# Altium project Smoke_Detector.PrjPcb (part 1 of 4)
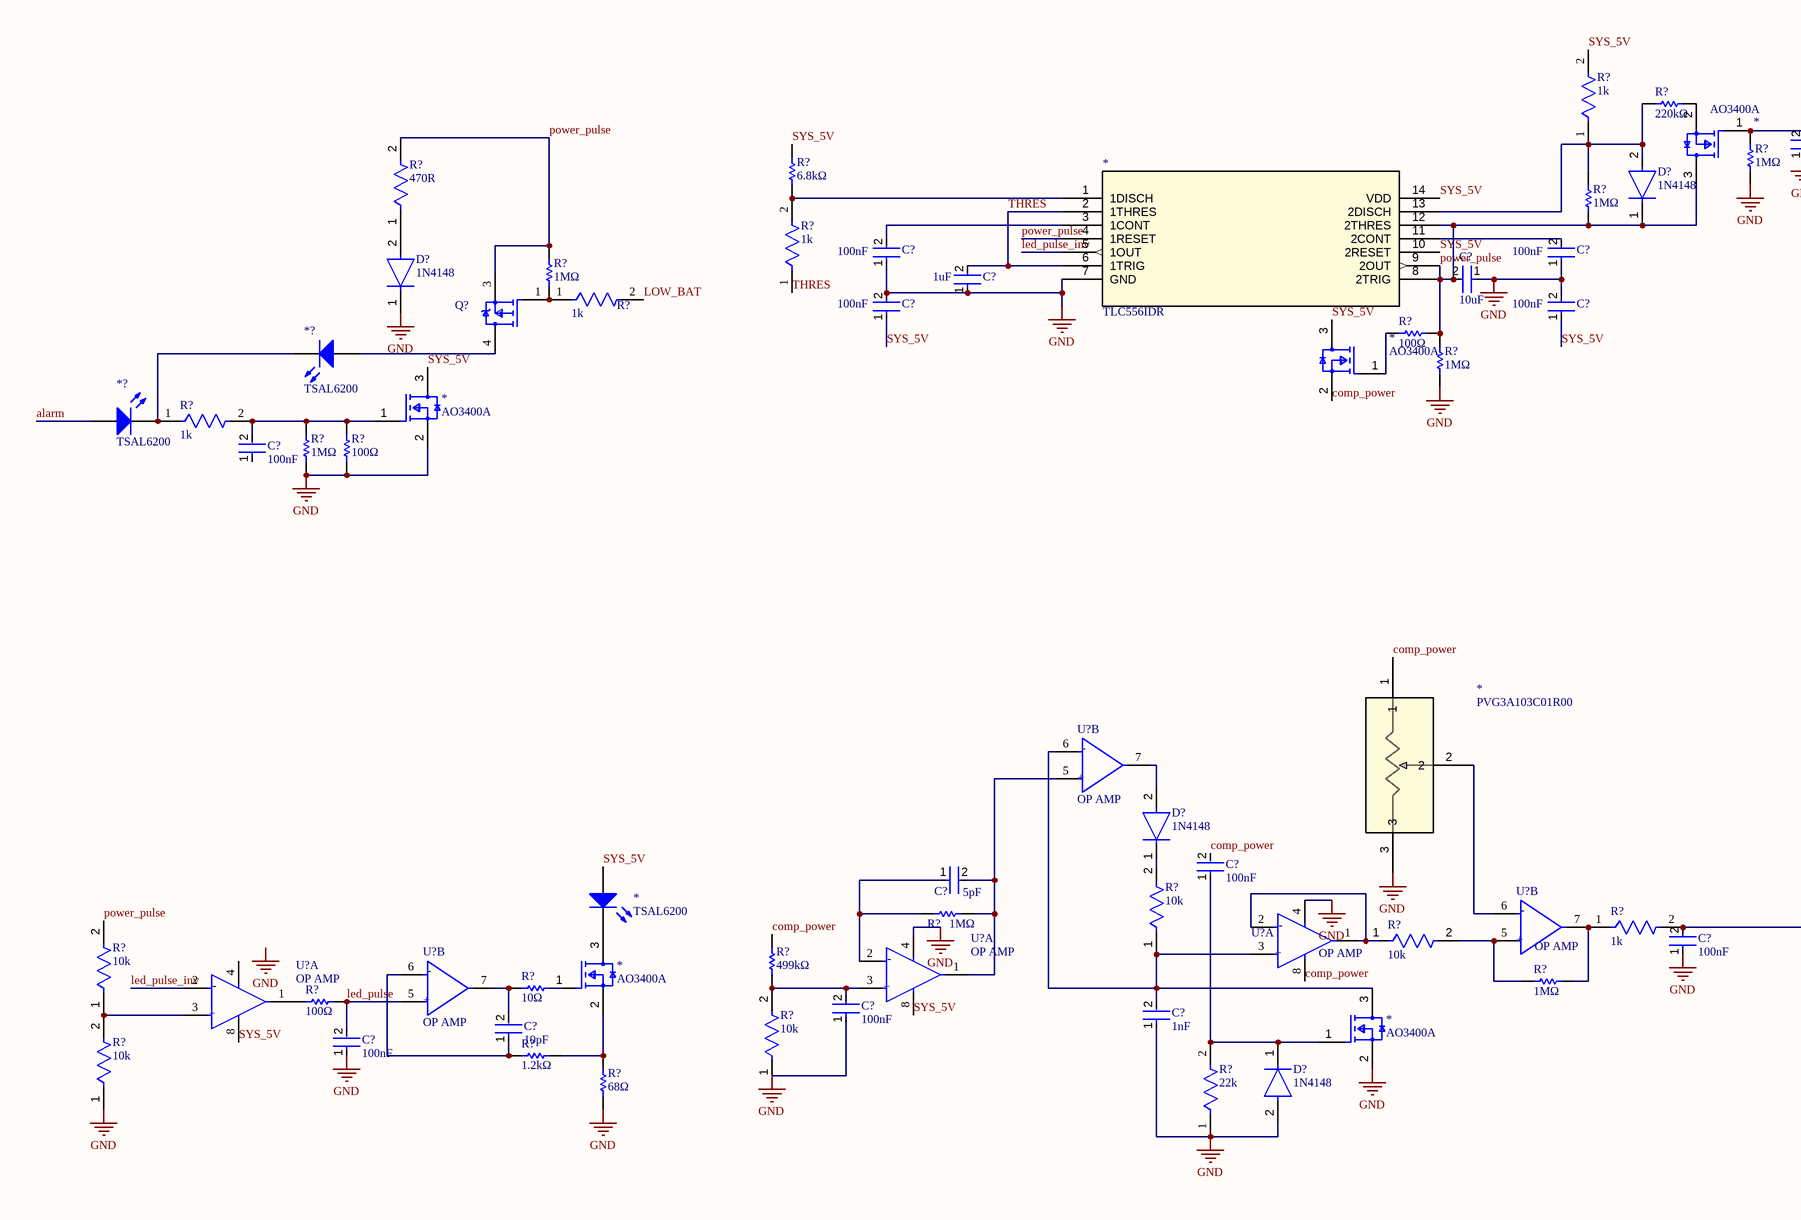
[diagram p0: Sheet1.SchDoc, left]
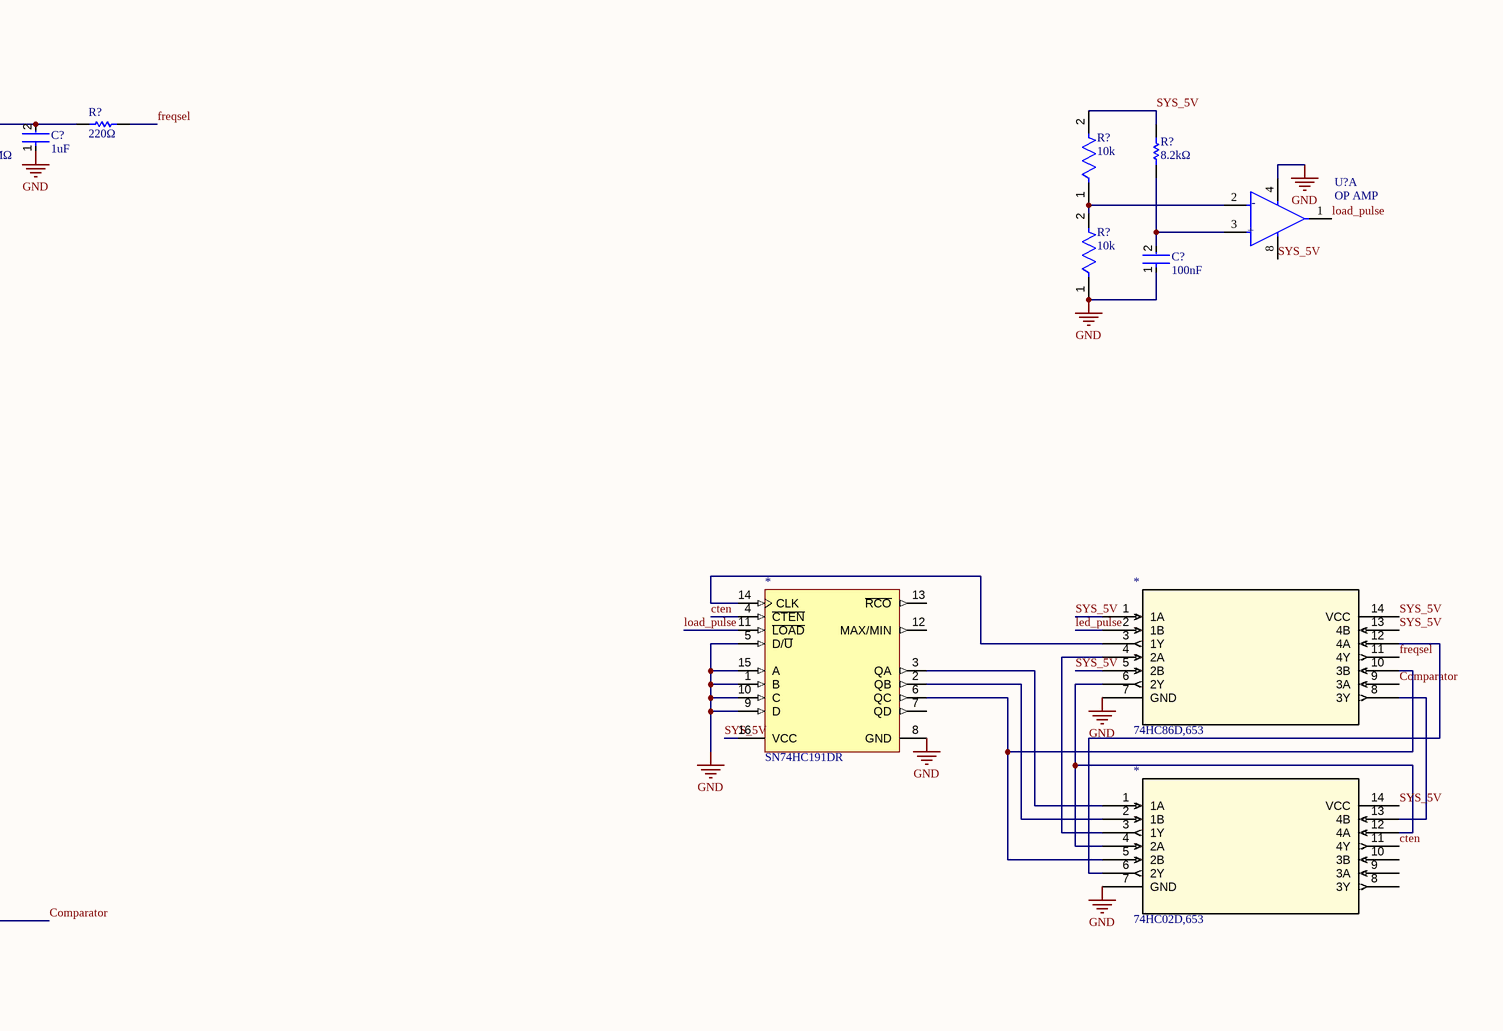
[diagram p1: Sheet1.SchDoc, right]
1 sheet, 73 parts. Net scope: global (net labels, ports and power ports of the same name join across sheets).

## Sheet Sheet1.SchDoc
size 863 x 558 mm; SheetNumber: 1; SheetTotal: 1

### Parts
(Parts that share a designator on the sheet are numbered #1, #2 ... from top to bottom, then left to right.)
*#1  AO3400A  [SOT23_TOS]
*#2  TLC556IDR  [D14]
*#3  AO3400A  [SOT23_TOS]
*#4  AO3400A  [SOT23_TOS]
*#5  74HC86D,653  [SOT108-1_NXP]
*#6  SN74HC191DR  [D0016A_N]
*#7  PVG3A103C01R00  [RES_C01R00]
*#8  74HC02D,653  [SOT108-1_NXP]
*#9  TSAL6200  [VISH-TSAL6200]
*#10  AO3400A  [SOT23_TOS]
*#11  AO3400A  [SOT23_TOS]
*?#1  TSAL6200  [VISH-TSAL6200]
*?#2  TSAL6200  [VISH-TSAL6200]
C?#1  1uF  [FP-C0805C-DN-IPC_B]
C?#2  100nF  [FP-C0805C-DN-IPC_B]
C?#3  100nF  [FP-C0805C-DN-IPC_B]
C?#4  10uF  [FP-C0805C-DN-IPC_B]
C?#5  100nF  [FP-C0805C-DN-IPC_B]
C?#6  1uF  [FP-C0805C-DN-IPC_B]
C?#7  100nF  [FP-C0805C-DN-IPC_B]
C?#8  100nF  [FP-C0805C-DN-IPC_B]
C?#9  100nF  [FP-C0805C-DN-IPC_B]
C?#10  5pF  [FP-C0805C-DN-IPC_B]
C?#11  100nF  [FP-C0805C-DN-IPC_B]
C?#12  100nF  [FP-C0805C-DN-IPC_B]
C?#13  100nF  [FP-C0805C-DN-IPC_B]
C?#14  1nF  [FP-C0805C-DN-IPC_B]
C?#15  10pF  [FP-C0805C-DN-IPC_B]
C?#16  100nF  [FP-C0805C-DN-IPC_B]
D?#1  1N4148  [FP-477AB-IPC_B]
D?#2  1N4148  [FP-477AB-IPC_B]
D?#3  1N4148  [FP-477AB-IPC_B]
D?#4  1N4148  [FP-477AB-IPC_B]
Q?  IRF4905  [FP-PG-TO263-3-MFG]  (value not drawn)
R?#1  220kΩ  [RESC2013X60X35NL10T20 - duplicate]
R?#2  1MΩ  [RESC2013X60X35NL10T20 - duplicate]
R?#3  220Ω  [RESC2013X60X35NL10T20 - duplicate]
R?#4  1k  [0805_RES]
R?#5  1MΩ  [RESC2013X60X35NL10T20 - duplicate]
R?#6  8.2kΩ  [RESC2013X60X35NL10T20 - duplicate]
R?#7  6.8kΩ  [RESC2013X60X35NL10T20 - duplicate]
R?#8  10k  [0805_RES]
R?#9  470R  [0805_RES]
R?#10  1MΩ  [RESC2013X60X35NL10T20 - duplicate]
R?#11  1k  [0805_RES]
R?#12  1k  [0805_RES]
R?#13  10k  [0805_RES]
R?#14  100Ω  [RESC2013X60X35NL10T20 - duplicate]
R?#15  1MΩ  [RESC2013X60X35NL10T20 - duplicate]
R?#16  1k  [0805_RES]
R?#17  1MΩ  [RESC2013X60X35NL10T20 - duplicate]
R?#18  100Ω  [RESC2013X60X35NL10T20 - duplicate]
R?#19  1MΩ  [RESC2013X60X35NL10T20 - duplicate]
R?#20  1k  [0805_RES]
R?#21  499kΩ  [RESC2013X60X35NL10T20]
R?#22  10k  [0805_RES]
R?#23  10k  [0805_RES]
R?#24  1MΩ  [RESC2013X60X35NL10T20 - duplicate]
R?#25  10Ω  [RESC2013X60X35NL10T20 - duplicate]
R?#26  100Ω  [RESC2013X60X35NL10T20 - duplicate]
R?#27  10k  [0805_RES]
R?#28  1.2kΩ  [RESC2013X60X35NL10T20 - duplicate]
R?#29  10k  [0805_RES]
R?#30  10k  [0805_RES]
R?#31  68Ω  [RESC2013X60X35NL10T20 - duplicate]
R?#32  22k  [0805_RES]
U?#1  OP AMP  [IC_TLV9062_8_SOIC]  (part A of 2)
U?#2  OP AMP  [IC_TLV9062_8_SOIC]  (part B of 2)
U?#3  OP AMP  [IC_TLV9062_8_SOIC]  (part B of 2)
U?#4  OP AMP  [IC_TLV9062_8_SOIC]  (part A of 2)
U?#5  OP AMP  [IC_TLV9062_8_SOIC]  (part A of 2)
U?#6  OP AMP  [IC_TLV9062_8_SOIC]  (part B of 2)
U?#7  OP AMP  [IC_TLV9062_8_SOIC]  (part A of 2)

### Nets
GND: *#2.7(GND) *#4.2(S) *#5.7(GND) *#6.1(B) *#6.5(D/~{U}) *#6.8(GND) *#6.9(D) *#6.10(C) *#6.15(A) *#7.3 *#8.7(GND) *#11.2(S) C?#1.1 C?#2.1 C?#3.1 C?#4.1 C?#5.1 C?#6.1 C?#7.2 C?#8.2 C?#12.1 C?#13.1 C?#14.1 C?#16.1 D?#2.1(C) D?#4.2(A) R?#2.1 R?#13.1 R?#15.1 R?#17.1 R?#18.1 R?#30.1 R?#31.1 R?#32.1 U?#1.4(V-) U?#4.4(V-) U?#5.4(V-)
alarm: *?#2.1(A)
comp_power: *#3.2(S) *#7.1 C?#11.2 R?#21.2 U?#4.8(V+)
Comparator: *#5.9(3A) C?#12.2 R?#20.2
cten: *#6.4(~{CTEN}) *#8.11(4Y)
freqsel: *#5.11(4Y) R?#3.2
led_pulse: *#5.2(1B) C?#16.2 R?#26.1 U?#6.5(IN2+)
led_pulse_inv: *#2.5(1OUT) U?#7.2(IN1-)
load_pulse: *#6.11(~{LOAD}) U?#1.1(OUT1)
LOW_BAT: R?#12.2
power_pulse: *#1.3(D) *#2.4(1RESET) *#2.8(2TRIG) *#2.9(2OUT) *#2.12(2THRES) C?#4.2 D?#1.1(C) Q?.3(S) R?#5.1 R?#9.2 R?#10.2 R?#14.2 R?#15.2 R?#27.2
SYS_5V: *#2.10(2RESET) *#2.14(VDD) *#3.3(D) *#4.3(D) *#5.1(1A) *#5.5(2B) *#5.13(4B) *#5.14(VCC) *#6.16(VCC) *#8.14(VCC) *#9.1(A) C?#7.1 C?#8.1 R?#4.2 R?#6.2 R?#7.2 R?#8.2 U?#1.8(V+) U?#5.8(V+) U?#7.8(V+)
THRES: *#2.2(1THRES) *#2.6(1TRIG) C?#6.2 R?#11.1
Net*#1_1: *#1.1(G) C?#1.2 R?#2.2 R?#3.1
Net*#1_2: *#1.2(S) R?#1.2
Net*#2_1: *#2.1(1DISCH) R?#7.1 R?#11.2
Net*#2_3: *#2.3(1CONT) C?#2.2
Net*#2_11: *#2.11(2CONT) C?#3.2
Net*#2_13: *#2.13(2DISCH) D?#1.2(A) R?#1.1 R?#4.1 R?#5.2
Net*#3_1: *#3.1(G) R?#14.1
Net*#4_1: *#4.1(G) C?#9.2 R?#16.2 R?#17.2 R?#18.2
Net*#5_3: *#5.3(1Y) *#6.14(CLK)
Net*#5_4: *#5.4(2A) *#8.3(1Y)
Net*#5_6: *#5.6(2Y) *#8.4(2A) *#8.12(4A)
Net*#5_8: *#5.8(3Y) *#8.13(4B)
Net*#5_10: *#5.10(3B) *#6.6(QC) *#8.5(2B)
Net*#5_12: *#5.12(4A) *#8.6(2Y)
Net*#6_2: *#6.2(QB) *#8.2(1B)
Net*#6_3: *#6.3(QA) *#8.1(1A)
Net*#7_2: *#7.2 U?#3.6(IN2-)
Net*#9_2: *#9.2(K) *#10.3(D)
Net*#10_1: *#10.1(G) R?#25.2
Net*#10_2: *#10.2(S) R?#28.2 R?#31.2
Net*#11_1: *#11.1(G) C?#11.1 D?#4.1(C) R?#32.2
Net*#11_3: *#11.3(D) C?#14.2 R?#23.1 U?#2.6(IN2-) U?#4.3(IN1+)
Net*?#1_1: *?#1.1(A) Q?.4(D)
Net*?#1_2: *?#1.2(K) *?#2.2(K) R?#16.1
NetC?#5_2: C?#5.2 R?#6.1 U?#1.3(IN1+)
NetC?#10_1: C?#10.1 R?#19.1 U?#5.2(IN1-)
NetC?#10_2: C?#10.2 R?#19.2 U?#2.5(IN2+) U?#5.1(OUT1)
NetC?#13_2: C?#13.2 R?#21.1 R?#29.2 U?#5.3(IN1+)
NetC?#15_1: C?#15.1 R?#28.1 U?#6.6(IN2-)
NetC?#15_2: C?#15.2 R?#25.1 U?#6.7(OUT2)
NetD?#2_2: D?#2.2(A) R?#9.1
NetD?#3_1: D?#3.1(C) R?#23.2
NetD?#3_2: D?#3.2(A) U?#2.7(OUT2)
NetQ?_1: Q?.1(G) R?#10.1 R?#12.1
NetR?#8_1: R?#8.1 R?#13.2 U?#1.2(IN1-)
NetR?#20_1: R?#20.1 R?#24.2 U?#3.7(OUT2)
NetR?#22_1: R?#22.1 U?#4.1(OUT1) U?#4.2(IN1-)
NetR?#22_2: R?#22.2 R?#24.1 U?#3.5(IN2+)
NetR?#26_2: R?#26.2 U?#7.1(OUT1)
NetR?#27_1: R?#27.1 R?#30.2 U?#7.3(IN1+)

Not connected (* = marked no-connect by the designer): *#6 7(QD) 12(MAX/MIN) 13(~{RCO}); *#8 8(3Y) 9(3A) 10(3B); C?#9 1; R?#29 1; U?#7 4(V-)

### Notes on the sheet
- Labels drawn without touching a wire or pin: GND
- DWG. NO.
- REV.
- SHT.
- REVISION
- DESCRIPTION
- DATE
- APPROVED
- THIS DOCUMENT AND THE DATA DISCLOSED HEREIN OR HEREWITH IS THE PROPERTY OF ALTIUM LIMITED AND MAY BE FREELY DISTRIBUTED IN WHOLE. NO RIGHTS ARE RESERVED OR EXPRESS OR IMPLIED WARANTEE GIVEN.
- ENG:
- DSN:
- APPROVALS
- PROJECT
- DOCUMENT REVISION:
- DESIGN ITEM:
- CHK:
- BOM:
- REFERENCE DOCUMENTS
- PROJECT REVISION:
- TITLE
- FAB DWG:
- PCB DWG:
- ASSY DWG:
- SCALE:
- SIZE
- D
- CAGE CODE
- FILE NAME
- DWG NO.
- SHEET
- OF
- REV